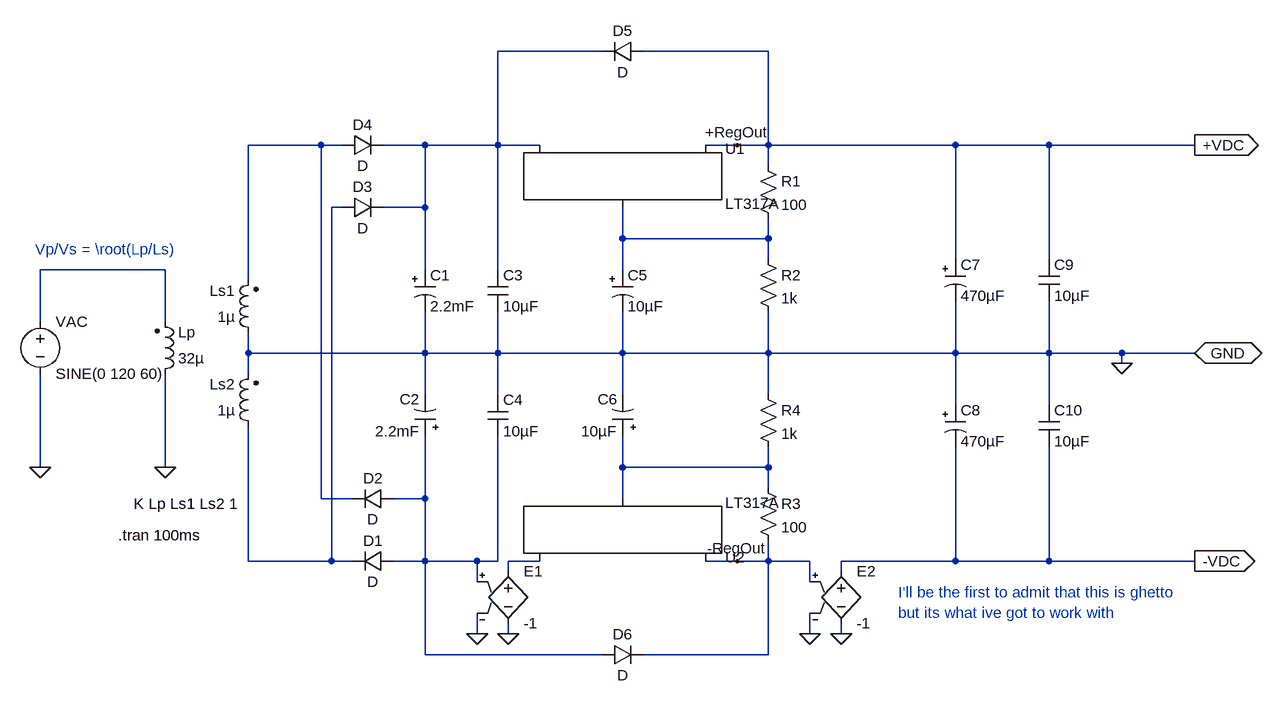
[diagram p0: schematic VariablePowerSupply.asc]
VariablePowerSupply.asc, the LTspice schematic file:
Version 4
SHEET 1 2220 1040
WIRE 816 -272 656 -272
WIRE 1072 -272 880 -272
WIRE 384 -128 272 -128
WIRE 416 -128 384 -128
WIRE 544 -128 480 -128
WIRE 656 -128 656 -272
WIRE 656 -128 544 -128
WIRE 720 -128 656 -128
WIRE 1024 -128 976 -128
WIRE 1072 -128 1072 -272
WIRE 1072 -128 1024 -128
WIRE 1360 -128 1072 -128
WIRE 1504 -128 1360 -128
WIRE 1728 -128 1504 -128
WIRE 1072 -96 1072 -128
WIRE 416 -32 400 -32
WIRE 544 -32 544 -128
WIRE 544 -32 480 -32
WIRE 848 16 848 -32
WIRE 1072 16 1072 -16
WIRE 1072 16 848 16
WIRE 1072 48 1072 16
WIRE 1360 48 1360 -128
WIRE 1504 48 1504 -128
WIRE 144 64 -48 64
WIRE 544 64 544 -32
WIRE 656 64 656 -128
WIRE 848 64 848 16
WIRE 272 80 272 -128
WIRE -48 144 -48 64
WIRE 144 144 144 64
WIRE 272 192 272 160
WIRE 544 192 544 128
WIRE 544 192 272 192
WIRE 656 192 656 128
WIRE 656 192 544 192
WIRE 848 192 848 128
WIRE 848 192 656 192
WIRE 1072 192 1072 128
WIRE 1072 192 848 192
WIRE 1360 192 1360 112
WIRE 1360 192 1072 192
WIRE 1504 192 1504 112
WIRE 1504 192 1360 192
WIRE 1616 192 1504 192
WIRE 1728 192 1616 192
WIRE 1616 208 1616 192
WIRE 272 224 272 192
WIRE 544 256 544 192
WIRE 656 256 656 192
WIRE 848 256 848 192
WIRE 1072 256 1072 192
WIRE 1360 272 1360 192
WIRE 1504 272 1504 192
WIRE -48 368 -48 224
WIRE 144 368 144 224
WIRE 848 368 848 320
WIRE 1072 368 1072 336
WIRE 1072 368 848 368
WIRE 1072 400 1072 368
WIRE 384 416 384 -128
WIRE 432 416 384 416
WIRE 544 416 544 320
WIRE 544 416 496 416
WIRE 848 416 848 368
WIRE 272 512 272 304
WIRE 400 512 400 -32
WIRE 400 512 272 512
WIRE 432 512 400 512
WIRE 544 512 544 416
WIRE 544 512 496 512
WIRE 624 512 544 512
WIRE 656 512 656 320
WIRE 656 512 624 512
WIRE 720 512 672 512
WIRE 1024 512 976 512
WIRE 1072 512 1072 480
WIRE 1072 512 1024 512
WIRE 1136 512 1072 512
WIRE 1360 512 1360 336
WIRE 1360 512 1184 512
WIRE 1504 512 1504 336
WIRE 1504 512 1360 512
WIRE 1728 512 1504 512
WIRE 672 528 672 512
WIRE 1184 528 1184 512
WIRE 624 544 624 512
WIRE 1136 544 1136 512
WIRE 624 624 624 592
WIRE 672 624 672 608
WIRE 1136 624 1136 592
WIRE 1184 624 1184 608
WIRE 544 656 544 512
WIRE 816 656 544 656
WIRE 1072 656 1072 512
WIRE 1072 656 880 656
FLAG -48 368 0
FLAG 144 368 0
FLAG 1728 -128 +VDC
IOPIN 1728 -128 Out
FLAG 1728 512 -VDC
IOPIN 1728 512 Out
FLAG 1728 192 GND
IOPIN 1728 192 BiDir
FLAG 1024 512 -RegOut
FLAG 1024 -128 +RegOut
FLAG 1616 208 0
FLAG 672 624 0
FLAG 624 624 0
FLAG 1184 624 0
FLAG 1136 624 0
SYMBOL voltage -48 128 R0
WINDOW 123 0 0 Left 2
WINDOW 39 0 0 Left 2
SYMATTR InstName VAC
SYMATTR Value SINE(0 120 60)
SYMBOL ind2 288 320 R180
WINDOW 0 36 80 Left 2
WINDOW 3 36 40 Left 2
SYMATTR InstName Ls2
SYMATTR Value 1µ
SYMATTR SpiceLine Rser=0.0001
SYMBOL ind2 288 176 R180
WINDOW 0 36 80 Left 2
WINDOW 3 36 40 Left 2
SYMATTR InstName Ls1
SYMATTR Value 1µ
SYMATTR SpiceLine Rser=0.0001
SYMBOL ind2 128 240 M180
WINDOW 0 36 80 Left 2
WINDOW 3 36 40 Left 2
SYMATTR InstName Lp
SYMATTR Value 32µ
SYMATTR SpiceLine Rser=0.001
SYMBOL diode 496 496 R90
WINDOW 0 0 32 VBottom 2
WINDOW 3 32 32 VTop 2
SYMATTR InstName D1
SYMBOL diode 496 400 R90
WINDOW 0 0 32 VBottom 2
WINDOW 3 32 32 VTop 2
SYMATTR InstName D2
SYMBOL diode 416 -16 R270
WINDOW 0 32 32 VTop 2
WINDOW 3 0 32 VBottom 2
SYMATTR InstName D3
SYMBOL diode 416 -112 R270
WINDOW 0 32 32 VTop 2
WINDOW 3 0 32 VBottom 2
SYMATTR InstName D4
SYMBOL cap 640 64 R0
SYMATTR InstName C3
SYMATTR Value 10µF
SYMBOL cap 640 256 R0
SYMATTR InstName C4
SYMATTR Value 10µF
SYMBOL polcap 528 64 R0
SYMATTR InstName C1
SYMATTR Value 2.2mF
SYMBOL polcap 560 320 R180
WINDOW 0 24 57 Left 2
WINDOW 3 24 8 Left 2
SYMATTR InstName C2
SYMATTR Value 2.2mF
SYMBOL polcap 1344 272 R0
SYMATTR InstName C8
SYMATTR Value 470µF
SYMBOL polcap 1344 48 R0
SYMATTR InstName C7
SYMATTR Value 470µF
SYMBOL cap 1488 272 R0
SYMATTR InstName C10
SYMATTR Value 10µF
SYMBOL cap 1488 48 R0
SYMATTR InstName C9
SYMATTR Value 10µF
SYMBOL res 1056 -112 R0
SYMATTR InstName R1
SYMATTR Value 100
SYMBOL res 1056 32 R0
SYMATTR InstName R2
SYMATTR Value 1k
SYMBOL res 1056 384 R0
SYMATTR InstName R3
SYMATTR Value 100
SYMBOL res 1056 240 R0
SYMATTR InstName R4
SYMATTR Value 1k
SYMBOL polcap 832 64 R0
SYMATTR InstName C5
SYMATTR Value 10µF
SYMBOL polcap 864 320 R180
WINDOW 0 24 57 Left 2
WINDOW 3 24 8 Left 2
SYMATTR InstName C6
SYMATTR Value 10µF
SYMBOL diode 880 -288 R90
WINDOW 0 0 32 VBottom 2
WINDOW 3 32 32 VTop 2
SYMATTR InstName D5
SYMBOL diode 816 672 R270
WINDOW 0 32 32 VTop 2
WINDOW 3 0 32 VBottom 2
SYMATTR InstName D6
SYMBOL PowerProducts\\LT317A 848 -128 R0
SYMATTR InstName U1
SYMBOL PowerProducts\\LT317A 848 512 M180
SYMATTR InstName U2
SYMBOL e 672 512 R0
SYMATTR InstName E1
SYMATTR Value -1
SYMBOL e 1184 512 R0
SYMATTR InstName E2
SYMATTR Value -1
TEXT 72 472 Left 2 !.tran 100ms
TEXT -56 32 Left 2 ;Vp/Vs = \\root(Lp/Ls)
TEXT 96 424 Left 2 !K Lp Ls1 Ls2 1
TEXT 1272 560 Left 2 ;I'll be the first to admit that this is ghetto\nbut its what ive got to work with

The netlist it stands for:
* VariablePowerSupply.asc
VAC N005 0 SINE(0 120 60)
Ls2 N003 0 1µ Rser=0.0001
Ls1 0 N002 1µ Rser=0.0001
Lp 0 N005 32µ Rser=0.001
D1 N007 N003 D
D2 N007 N002 D
D3 N003 N001 D
D4 N002 N001 D
C3 N001 0 10µF
C4 0 N007 10µF
C1 N001 0 2.2mF
C2 N007 0 2.2mF
C8 0 -VDC 470µF
C7 +RegOut 0 470µF
C10 0 -VDC 10µF
C9 +RegOut 0 10µF
R1 +RegOut N004 100
R2 N004 0 1k
R3 N006 -RegOut 100
R4 0 N006 1k
C5 N004 0 10µF
C6 N006 0 10µF
D5 +RegOut N001 D
D6 N007 -RegOut D
XU1 N004 +RegOut N001 LT317A
XU2 N006 -RegOut N008 LT317A
E1 N008 0 N007 0 -1
E2 -VDC 0 -RegOut 0 -1
.model D D
.lib standard.dio
.tran 100ms
* Vp/Vs = \root(Lp/Ls)
K Lp Ls1 Ls2 1
* I'll be the first to admit that this is ghetto
* but its what ive got to work with
.lib LTC.lib
.backanno
.end